# Altium schematic sheet ch340-usb-serial.SchDoc
size A3; SheetNumber: 1; SheetTotal: 1
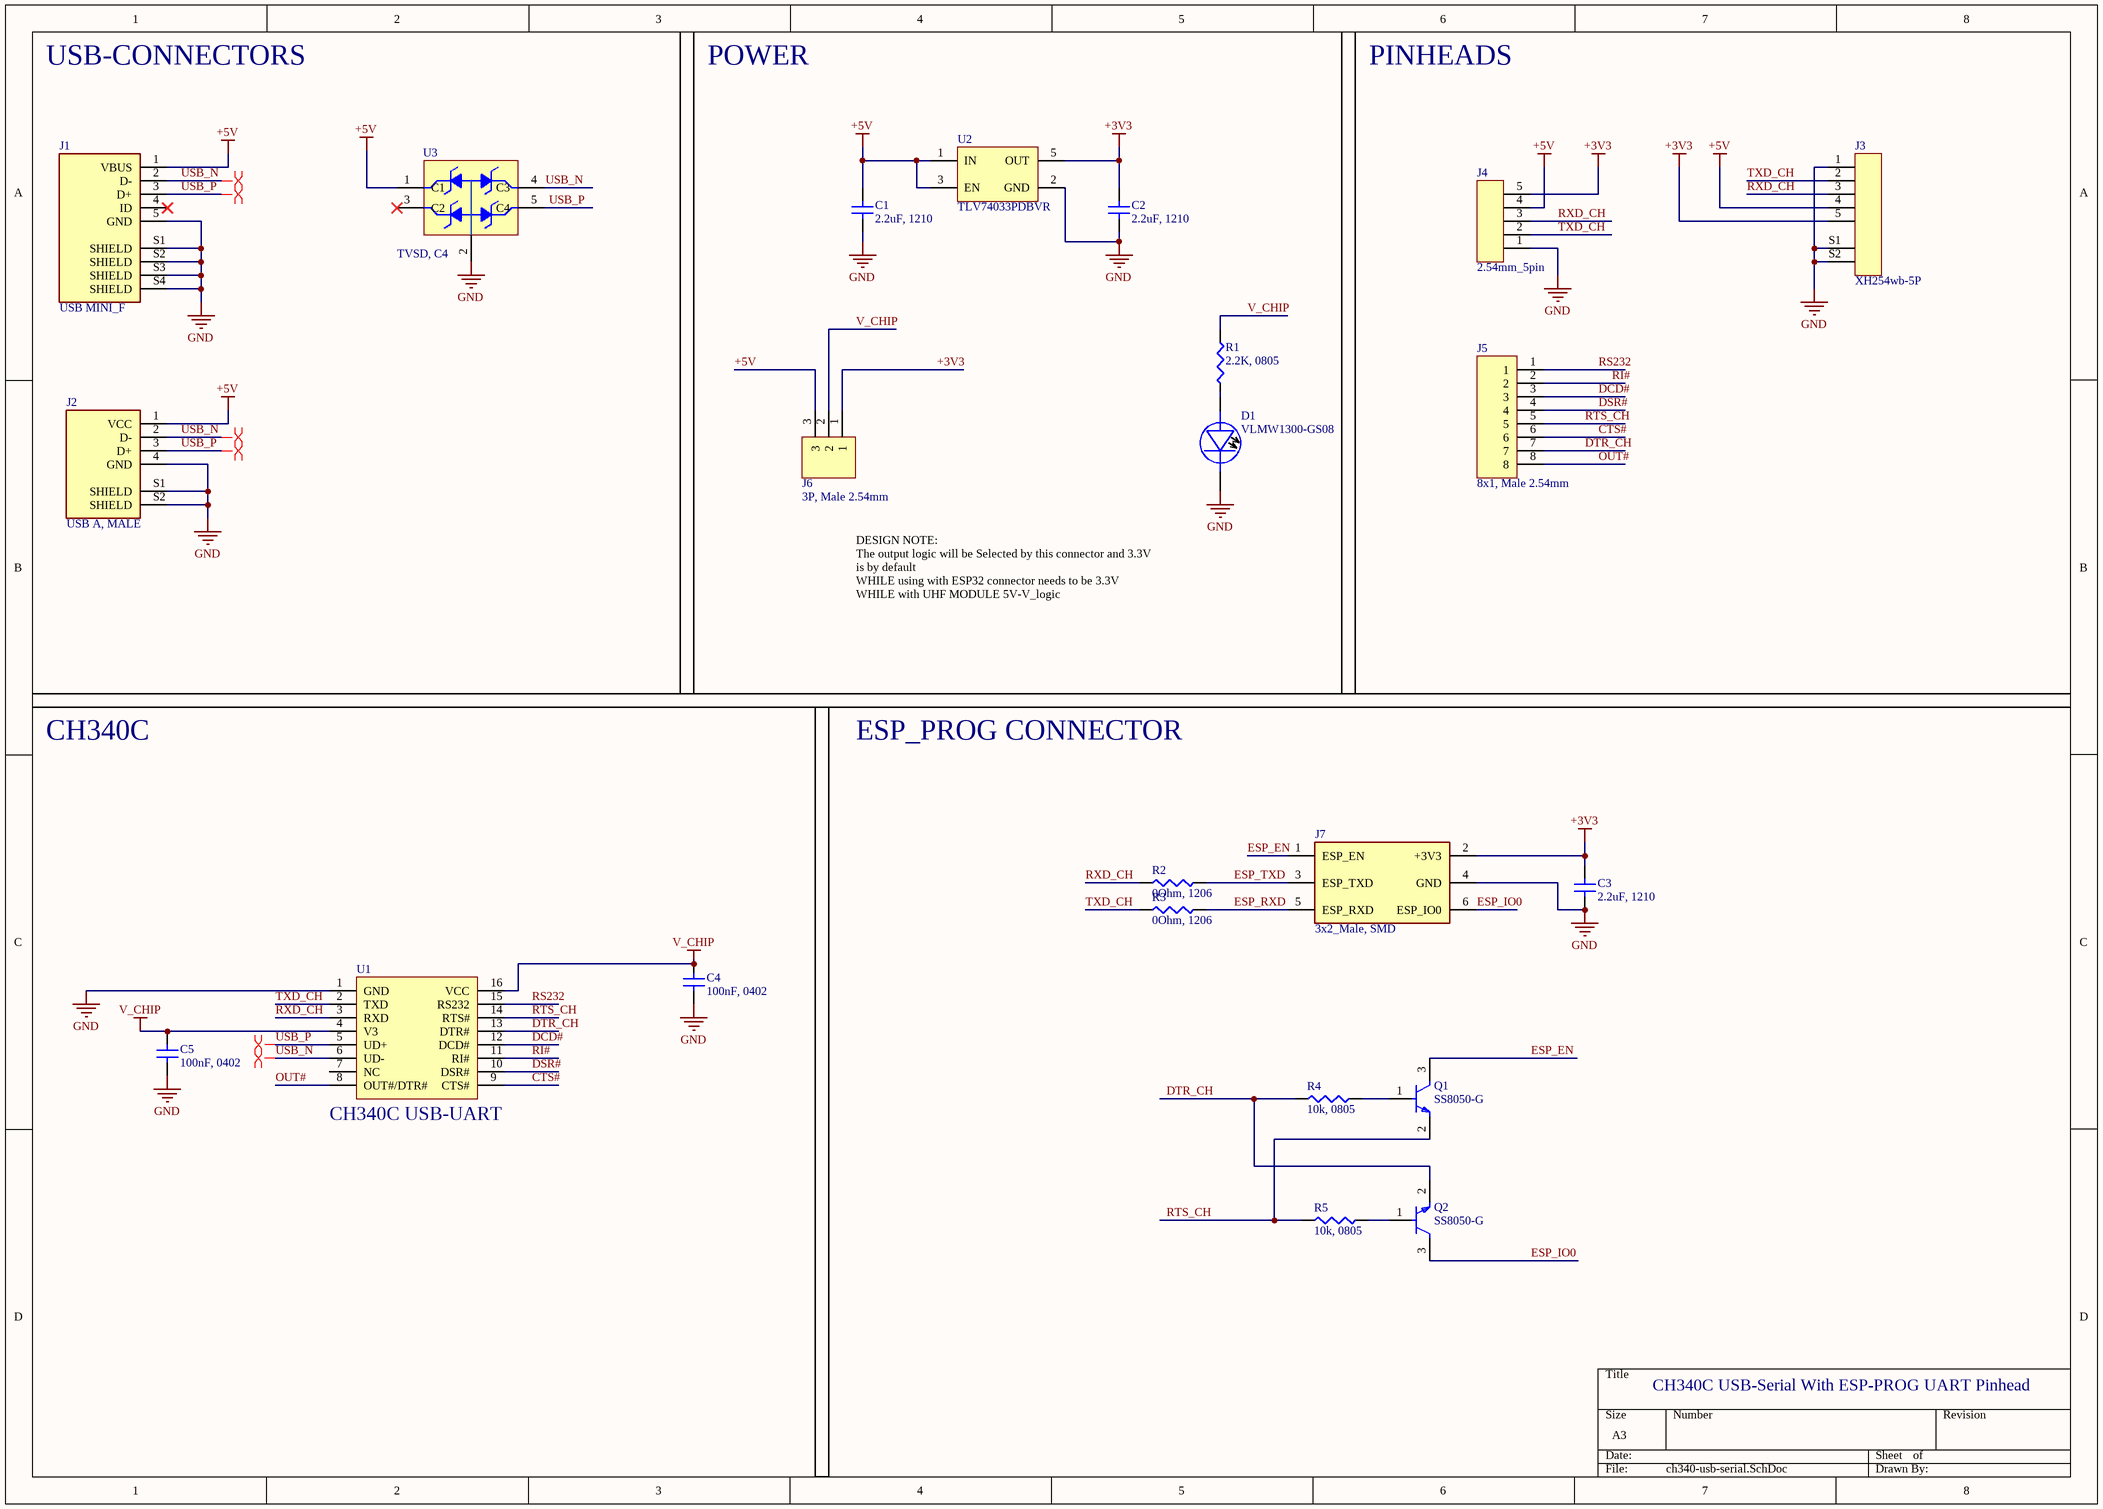
[diagram p0: ch340-usb-serial.SchDoc]

## Parts
C1  2.2uF, 1210  [CAP_1210]
C2  2.2uF, 1210  [CAP_1210]
C3  2.2uF, 1210  [CAP_1210]
C4  100nF, 0402  [CAP_0402]
C5  100nF, 0402  [CAP_0402]
D1  VLMW1300-GS08  [LED_0603]
J1  USB MINI_F  [USB_B_Female]
J2  USB A, MALE  [USB_A_MALE]
J3  XH254wb-5P  [5PIN_Header_Connectotor]
J4  2.54mm_5pin  [5x1P_Male_2.54]
J5  8x1, Male 2.54mm  [8x1P_Male_2.54]
J6  3P, Male 2.54mm  [3x1P_Male_2.54]
J7  3x2_Male, SMD  [3x2P_Male_SMD_1.27]
Q1  SS8050-G  [FP-SS8050-G-IPC_B]
Q2  SS8050-G  [FP-SS8050-G-IPC_B]
R1  2.2K, 0805  [RES_0805]
R2  0Ohm, 1206  [RES_1206]
R3  0Ohm, 1206  [RES_1206]
R4  10k, 0805  [RES_0805]
R5  10k, 0805  [RES_0805]
U1  USB-UART  [SOP16]  (value not drawn)
U2  TLV74033PDBVR  [SOT95P280X145-5N]
U3  TVSD, C4  [SOT353]

## Nets
+3V3: C2.1 C3.1 J3.5 J4.5 J6.1 J7.2(+3V3) U2.5(OUT)
+5V: C1.1 J1.1(VBUS) J2.1(VCC) J3.4 J4.4 J6.3 U2.1(IN) U2.3(EN) U3.1(C1)
GND: C1.2 C2.2 C3.2 C4.1 C5.1 D1.K- J1.5(GND) J1.S1(SHIELD) J1.S2(SHIELD) J1.S3(SHIELD) J1.S4(SHIELD) J2.4(GND) J2.S1(SHIELD) J2.S2(SHIELD) J3.1 J3.S1 J3.S2 J4.1 J7.4(GND) U1.1(GND) U2.2(GND) U3.2(A)
V_CHIP: C4.2 C5.2 J6.2 R1.2 U1.4(V3) U1.16(VCC)
CTS#: J5.6 U1.9(CTS#)
DCD#: J5.3 U1.12(DCD#)
DSR#: J5.4 U1.10(DSR#)
DTR_CH: J5.7 Q2.2(E) R4.1 U1.13(DTR#)
ESP_EN: J7.1(ESP_EN) Q1.3(C)
ESP_IO0: J7.6(ESP_IO0) Q2.3(C)
ESP_RXD: J7.5(ESP_RXD) R3.2
ESP_TXD: J7.3(ESP_TXD) R2.2
OUT#: J5.8 U1.8(OUT#/DTR#)
RI#: J5.2 U1.11(RI#)
RS232: J5.1 U1.15(RS232)
RTS_CH: J5.5 Q1.2(E) R5.1 U1.14(RTS#)
RXD_CH: J3.3 J4.3 R2.1 U1.3(RXD)
TXD_CH: J3.2 J4.2 R3.1 U1.2(TXD)
USB_N: J1.2(D-) J2.2(D-) U1.6(UD-) U3.4(C3)
USB_P: J1.3(D+) J2.3(D+) U1.5(UD+) U3.5(C4)
NetD1_A+: D1.A+ R1.1
NetQ1_1: Q1.1(B) R4.2
NetQ2_1: Q2.1(B) R5.2

Not connected (* = marked no-connect by the designer): J1 4(ID)*; U1 7(NC); U3 3(C2)*

## Layout directives
differential pair; differential pair class DIFF90: USB_N, USB_P

## Notes on the sheet
- USB-CONNECTORS
- POWER
- PINHEADS
- DESIGN NOTE:
  The output logic will be Selected by this connector and 3.3V is by default
  WHILE using with ESP32 connector needs to be 3.3V
  WHILE with UHF MODULE 5V-V_logic
- CH340C
- ESP_PROG CONNECTOR
- CH340C USB-Serial With ESP-PROG UART Pinhead
- (in symbol CH340C) CH340C USB-UART

## Library data of the parts
C1-C3 = CL32B225KCJSNNE: CAP CER 2.2UF 100V X7R 1210; Manufacturer: Samsung; Dielectric Material: Ceramic; Multilayer: Yes; Tolerance  (fill in as +-): 10%; Supplier: Digikey; Supplier Part Number: 1276-3362-6-ND; Manufacturer Part Number: CL32B225KCJSNNE; RoHS: Yes; Category: Ceramic Capacitors; Stock: 239814; Pricing: 1=0.43, 10=0.286, 50=0.228, 100=0.1882, 500=0.14706 (USD); Mounting Technology: Surface Mount; Pins: 2; Package Shape: Rectangular; Case/Package: 1210; Terminal Finish: Nickel; Min Operating Temperature: -55°C; Max Operating Temperature: 125°C; JESD-609 Code: e3; Value: 2.2uF; Capacitor Type: Ceramic; Packaging: Tape and Reel; Tolerance (fill in as +-): 10%; Rated DC Voltage (URdc): 100V; Temperature Characteristics Code: X7R; Termination: Wraparound; Reach SVHC Compliant: Yes; RoHS Compliant: Yes; ComponentLink1URL: https://datasheet.ciiva.com:443/pdfs/VipMasterIC/IC/SEMS/SEMS-S-A0008526420/SEMS-S-A0008525306-1.pdf?src-supplier=IHS+Markit; ComponentLink1Description: https://datasheet.ciiva.com:443/pdfs/VipMasterIC/IC/SEMS/SEMS-S-A0008526420/SEMS-S-A0008525306-1.pdf?src-supplier=IHS+Markit; ComponentLink2URL: https://datasheet.ciiva.com/25791/cl32b225kcjsnne-25791527.pdf?src-supplier=Digikey; ComponentLink2Description: https://datasheet.ciiva.com/25791/cl32b225kcjsnne-25791527.pdf?src-supplier=Digikey; ComponentLink3URL: https://datasheet.ciiva.com/26947/getdatasheetpartid-357497-26947037.pdf?src-supplier=Verical; ComponentLink3Description: https://datasheet.ciiva.com/26947/getdatasheetpartid-357497-26947037.pdf?src-supplier=Verical; ComponentLink4URL: https://datasheet.ciiva.com/16437/cl32b225kcjsnne-16437175.pdf?src-supplier=Future+Electronics; ComponentLink4Description: https://datasheet.ciiva.com/16437/cl32b225kcjsnne-16437175.pdf?src-supplier=Future+Electronics
C4 C5 = CL05B104KB54PNC: 0.1 µF ±10% 50V Ceramic Capacitor X7R 0402 (1005 Metric); Manufacturer: Samsung; Material: 4241ConductorMaterial; Supplier: Arrow Electronics; Supplier Part Number: CL05B104KB54PNC; Manufacturer Part Number: CL05B104KB54PNC; RoHS: Yes; Category: Ceramic Capacitors; Stock: 2120000; Pricing: 10000=0.0057 (USD); Case/Package: 343Case; Min Operating Temperature: -55°C; Max Operating Temperature: 125°C; Tolerance: 10%; Voltage Rating: 50V; Value: 100nF; Height: 550um; RoHS Compliant: Yes; ComponentLink1URL: https://datasheet.octopart.com/CL05B104KB54PNC-Samsung-datasheet-8326407.pdf?src-supplier=TME; ComponentLink1Description: https://datasheet.octopart.com/CL05B104KB54PNC-Samsung-datasheet-8326407.pdf?src-supplier=TME; LCSC Part Number: C307331
D1 = VLMW1300-GS08: LED COOL WHITE 0603 SMD; Manufacturer: Vishay Semiconductors; Shape: Rectangular; Additional Feature: HIGH RELIABILITY; Forward Current: 20mA; Forward Voltage: 3.15V; Luminous Intensity-Nom: 112.5mcd; Channels: 1; Optoelectronic Device Type: SINGLE COLOR LED; Viewing Angle: 130°; Overall Height: 0.55mm; Supplier: Digikey; Supplier Part Number: VLMW1300-GS08CT-ND; Manufacturer Part Number: VLMW1300-GS08; RoHS: Yes; Category: LEDs; Stock: 7313; Pricing: 1=0.46, 10=0.266, 100=0.1687, 500=0.13056, 1000=0.11887 (USD); Mounting Technology: Surface Mount; Pins: 2; Color: White; Color@wavelength: White; Min Operating Temperature: -20°C; Max Operating Temperature: 80°C; Packaging: Tape and Reel; Size: 1.1mm; Terminal Pitch: 1.5mm; Reach SVHC Compliant: Yes; RoHS Compliant: Yes; ComponentLink1URL: https://datasheet.ciiva.com:443/pdfs/VipMasterIC/IC/VISH/VISH-S-A0001807432/VISH-S-A0001807432-1.pdf?src-supplier=IHS+Markit; ComponentLink1Description: https://datasheet.ciiva.com:443/pdfs/VipMasterIC/IC/VISH/VISH-S-A0001807432/VISH-S-A0001807432-1.pdf?src-supplier=IHS+Markit; ComponentLink2URL: https://datasheet.ciiva.com/6858/vlmw1300-6858354.pdf?src-supplier=Newark; ComponentLink2Description: https://datasheet.ciiva.com/6858/vlmw1300-6858354.pdf?src-supplier=Newark; ComponentLink3URL: https://datasheet.ciiva.com/4688/vlmw1300-98499-4688159.pdf?src-supplier=Mouser; ComponentLink3Description: https://datasheet.ciiva.com/4688/vlmw1300-98499-4688159.pdf?src-supplier=Mouser; ComponentLink4URL: https://datasheet.ciiva.com/14650/vlmw1300-14650411.pdf?src-supplier=Element14; ComponentLink4Description: https://datasheet.ciiva.com/14650/vlmw1300-14650411.pdf?src-supplier=Element14; ComponentLink5URL: https://datasheet.ciiva.com/14650/vlmw1300-14650412.pdf?src-supplier=Element14; ComponentLink5Description: https://datasheet.ciiva.com/14650/vlmw1300-14650412.pdf?src-supplier=Element14; ComponentLink6URL: https://datasheet.ciiva.com/16388/vlmw1300-16388055.pdf?src-supplier=Future+Electronics; ComponentLink6Description: https://datasheet.ciiva.com/16388/vlmw1300-16388055.pdf?src-supplier=Future+Electronics
J1 = GMSB0532112YEU: MINI USB B TYPE RECEPTACLE 5POS; Manufacturer: Amphenol; Supplier: Digikey; Supplier Part Number: 664-GMSB0532112YEUDKR-ND; Manufacturer Part Number: GMSB0532112YEU; RoHS: No; Category: Connectors; Stock: 5615; Pricing: 1=0.55, 10=0.476, 25=0.4352, 50=0.4094, 100=0.3924, 250=0.35824, 500=0.34118 (USD)
J2 = 0480372200: CONN PLUG USB2.0 TYPEA 4P SMD RA; Manufacturer: Molex; Option: General Purpose; Empty Shell: No; Number of Contacts: 4; Mating Information: MULTIPLE MATING PARTS AVAILABLE; Supplier: Digikey; Supplier Part Number: WM3983CT-ND; Manufacturer Part Number: 0480372200; RoHS: Yes; Stock: 18158; Pricing: 1=1.45, 10=1.199, 100=0.9993 (USD); Mounting Technology: Panel,Board; Contact Finish - Mating: GOLD (30); Contact Finish - Termination: TIN; Connector Type: USB; Body/Shell Style: PLUG; Contact Gender: Male; Filter Feature: No; Mixed Contacts: No; Mounting Style: RIGHT ANGLE; Termination: SMD/SMT; JESD-609 Code: e3; Reach SVHC Compliant: Yes; RoHS Compliant: Yes; DIN Conformance: No; IEC Conformance: No; MIL Conformance: No; ComponentLink1URL: https://datasheet.ciiva.com:443/pdfs/VipMasterIC/IC/MOLE/MOLES33218/MOLES28897-1.pdf?src-supplier=IHS+Markit; ComponentLink1Description: https://datasheet.ciiva.com:443/pdfs/VipMasterIC/IC/MOLE/MOLES33218/MOLES28897-1.pdf?src-supplier=IHS+Markit
J3 = XH254wb-5P: SMT SMD Horizontal Socket Male Header Connector
J4 = 2.54mm_5pin: CONN HEADER VERT 5POS 2.54MM
J5 = 61300811121: CONN HEADER VERT 8POS 2.54MM; Manufacturer: Wurth Electronics; Manufacturer Series: 613; Connector Type: BOARD CONNECTOR; Body/Shell Style: PLUG; Contact Pattern: RECTANGULAR; Contact Resistance: 20mR; Contact Style: SQ PIN-SKT; Dielectric Withstanding Voltage (AC): 500V; Insulation Resistance: 1GR; Number Of Connectors: 1; Rated Current (Signal): 3A; Number of Contacts: 8; Body Breadth: 0.1inch; Body Length: 0.8inch; Mounting Option 1: LOCKING; Reference Standard: UL; Reliability: COMMERCIAL; Supplier: Digikey; Supplier Part Number: 732-5321-ND; Manufacturer Part Number: 61300811121; RoHS: Yes; Category: Headers and Wire Housings; Stock: 8009; Pricing: 1=0.39, 10=0.336, 25=0.28, 50=0.234, 100=0.212, 1000=0.193 (USD); Mounting Technology: Board; Contact Material: Copper Alloy; Contact Finish - Mating: AU; Contact Finish - Termination: Gold (Au) - with Nickel (Ni) barrier; Insulation Color: Black; Insulation Material: Polybutylene; Min Operating Temperature: -40°C; Max Operating Temperature: 125°C; JESD-609 Code: e4; Contact Gender: Male; Mounting Style: STRAIGHT; Number of Rows Loaded: 1; PCB Contact Pattern: RECTANGULAR; Termination: Solder; Body Depth: 0.1inch; Mating Contact Pitch: 0.1inch; Terminal Length: 0.118inch; Terminal Pitch: 2.54mm; Reach SVHC Compliant: Yes; RoHS Compliant: Yes; ComponentLink1URL: https://datasheet.ciiva.com:443/pdfs/VipMasterIC/IC/MIDC/MIDCS07676/MIDCS07676-1.pdf?src-supplier=IHS+Markit; ComponentLink1Description: https://datasheet.ciiva.com:443/pdfs/VipMasterIC/IC/MIDC/MIDCS07676/MIDCS07676-1.pdf?src-supplier=IHS+Markit; ComponentLink2URL: https://datasheet.octopart.com/61300811121-W%C3%BCrth-Elektronik-datasheet-21154836.pdf?src-supplier=Element14; ComponentLink2Description: https://datasheet.octopart.com/61300811121-W%C3%BCrth-Elektronik-datasheet-21154836.pdf?src-supplier=Element14; ComponentLink3URL: https://katalog.we-online.de/em/datasheet/6130xx11121.pdf?src-supplier=Digikey; ComponentLink3Description: https://katalog.we-online.de/em/datasheet/6130xx11121.pdf?src-supplier=Digikey
J6 = 61300311121: CONN HEADER VERT 3POS 2.54MM; Manufacturer: Wurth Electronics; Connector Type: BOARD CONNECTOR; Body/Shell Style: PLUG; Contact Pattern: RECTANGULAR; Contact Resistance: 20mR; Contact Style: SQ PIN-SKT; Dielectric Withstanding Voltage (AC): 500V; Insulation Resistance: 1GR; Number Of Connectors: 1; Rated Current (Signal): 3A; Number of Contacts: 3; Body Breadth: 0.1inch; Body Length: 0.3inch; Mounting Option 1: LOCKING; Reference Standard: UL; Reliability: COMMERCIAL; Supplier: Digikey; Supplier Part Number: 732-5316-ND; Manufacturer Part Number: 61300311121; RoHS: Yes; Category: Headers and Wire Housings; Stock: 134142; Pricing: 1=0.13, 10=0.113, 25=0.094, 50=0.079, 100=0.071, 1000=0.066 (USD); Mounting Technology: Board; Contact Material: Copper Alloy; Contact Finish - Mating: GOLD; Contact Finish - Termination: Gold (Au) - with Nickel (Ni) barrier; Insulation Color: Black; Insulation Material: Polybutylene; Min Operating Temperature: -40°C; Max Operating Temperature: 125°C; JESD-609 Code: e4; Contact Gender: Male; Mounting Style: STRAIGHT; Number of Rows Loaded: 1; PCB Contact Pattern: RECTANGULAR; Termination: Solder; Body Depth: 0.1inch; Mating Contact Pitch: 0.1inch; Terminal Length: 0.118inch; Terminal Pitch: 2.54mm; Reach SVHC Compliant: Yes; RoHS Compliant: Yes; ComponentLink1URL: https://datasheet.ciiva.com:443/pdfs/VipMasterIC/IC/MIDC/MIDCS07676/MIDCS07676-1.pdf?src-supplier=IHS+Markit; ComponentLink1Description: https://datasheet.ciiva.com:443/pdfs/VipMasterIC/IC/MIDC/MIDCS07676/MIDCS07676-1.pdf?src-supplier=IHS+Markit; ComponentLink2URL: http://www.farnell.com/cad/1737268.pdf?src-supplier=Element14; ComponentLink2Description: http://www.farnell.com/cad/1737268.pdf?src-supplier=Element14; ComponentLink3URL: https://datasheet.octopart.com/61300311121-W%C3%BCrth-Elektronik-datasheet-21154836.pdf?src-supplier=Element14; ComponentLink3Description: https://datasheet.octopart.com/61300311121-W%C3%BCrth-Elektronik-datasheet-21154836.pdf?src-supplier=Element14; ComponentLink4URL: https://katalog.we-online.de/em/datasheet/6130xx11121.pdf?src-supplier=Digikey; ComponentLink4Description: https://katalog.we-online.de/em/datasheet/6130xx11121.pdf?src-supplier=Digikey
J7 = 20021121-00006C4LF: CONN HEADER SMD 6POS 1.27MM; Manufacturer: Amphenol Communications Solutions; Supplier: Digikey; Supplier Part Number: 609-3693-1-ND; Manufacturer Part Number: 20021121-00006C4LF; RoHS: No; Category: Headers and Wire Housings; Stock: 7493; Pricing: 1=0.8, 10=0.612, 100=0.4694 (USD)
Q1 Q2 = SS8050-G: TRANS NPN 25V 1.5A SOT23-3; Manufacturer: Comchip; Supplier: Digikey; Supplier Part Number: 641-1790-1-ND; Manufacturer Part Number: SS8050-G; RoHS: Yes; Category: Transistors; Stock: 90458; Pricing: 1=0.29, 10=0.2, 100=0.0978, 500=0.08154, 1000=0.05666 (USD); Reach SVHC Compliant: Yes; RoHS Compliant: Yes; ComponentLink1URL: https://datasheet.ciiva.com:443/pdfs/VipMasterIC/IC/COMC/COMC-S-A0004994192/COMC-S-A0004994192-1.pdf?src-supplier=IHS+Markit; ComponentLink1Description: https://datasheet.ciiva.com:443/pdfs/VipMasterIC/IC/COMC/COMC-S-A0004994192/COMC-S-A0004994192-1.pdf?src-supplier=IHS+Markit; ComponentLink2URL: http://www.comchiptech.com/admin/files/product/SS8050-G RevA181526.pdf?src-supplier=Digikey; ComponentLink2Description: http://www.comchiptech.com/admin/files/product/SS8050-G RevA181526.pdf?src-supplier=Digikey; LCSC Part Number: C164886
R1 = CRCW08052K20FKEC: RES SMD 2.2K OHM 1% 1/8W 0805; Manufacturer: Vishay Dale; Power: 125mW; Rated Temperature: 70°C; Value: 2.2kR; Temperature Coefficient: 100ppm/°C; Working Voltage: 150V; Package Height: 0.45mm; Package Length: 2mm; Package Width: 1.25mm; Reference Standard: AEC-Q200; Supplier: Digikey; Supplier Part Number: 541-CRCW08052K20FKECCT-ND; Manufacturer Part Number: CRCW08052K20FKEC; RoHS: Yes; Category: Chip SMD Resistors; Stock: 19945; Pricing: 1=0.1, 10=0.039, 50=0.025, 100=0.021, 500=0.01444, 1000=0.0125, 5000=0.00933, 10000=0.00838 (USD); Mounting Technology: Surface Mount; Pins: 2; Package Shape: Rectangular; Case/Package: 0805; Terminal Finish: Nickel; Min Operating Temperature: -55°C; Max Operating Temperature: 155°C; Tolerance: 1%; JESD-609 Code: e3; Resistor Type: FIXED RESISTOR; Construction: Chip; Package Style: SMTMeter; Packaging: Tape and Reel; Technology: METAL GLAZE/THICK FILM; Termination: Wraparound; Reach SVHC Compliant: Yes; RoHS Compliant: Yes; ComponentLink1URL: https://datasheet.ciiva.com:443/pdfs/VipMasterIC/IC/VISH/VISH-S-A0007266705/VISH-S-A0007266705-1.pdf?src-supplier=IHS+Markit; ComponentLink1Description: https://datasheet.ciiva.com:443/pdfs/VipMasterIC/IC/VISH/VISH-S-A0007266705/VISH-S-A0007266705-1.pdf?src-supplier=IHS+Markit; ComponentLink2URL: http://www.vishay.com/docs/20035/dcrcwe3.pdf?src-supplier=Digikey; ComponentLink2Description: http://www.vishay.com/docs/20035/dcrcwe3.pdf?src-supplier=Digikey
R2 R3 = RC1206JR-070RL: RES 0 OHM JUMPER 1/4W 1206; Manufacturer: Yageo; Power: 250mW; Rated Temperature: 70°C; Value: 0R; Package Height: 0.55mm; Package Length: 3.1mm; Package Width: 1.6mm; Supplier: Digikey; Supplier Part Number: 311-0.0ERCT-ND; Manufacturer Part Number: RC1206JR-070RL; RoHS: Yes; Category: Chip SMD Resistors; Stock: 903635; Pricing: 1=0.1, 10=0.048, 25=0.0364, 50=0.0276, 100=0.0193, 250=0.01556, 500=0.01244, 1000=0.00915 (USD); Mounting Technology: Surface Mount; Pins: 2; Package Shape: Rectangular; Case/Package: 1206; Terminal Finish: Nickel; Min Operating Temperature: -55°C; Max Operating Temperature: 155°C; JESD-609 Code: e3; Resistor Type: FIXED RESISTOR; Construction: Chip; Package Style: SMTMeter; Packaging: Tape and Reel; Technology: METAL GLAZE/THICK FILM; Termination: Wraparound; Reach SVHC Compliant: Yes; RoHS Compliant: Yes; ComponentLink1URL: https://datasheet.ciiva.com:443/pdfs/VipMasterIC/IC/YAGO/YAGO-S-A0008145938/YAGO-S-A0008145938-1.pdf?src-supplier=IHS+Markit; ComponentLink1Description: https://datasheet.ciiva.com:443/pdfs/VipMasterIC/IC/YAGO/YAGO-S-A0008145938/YAGO-S-A0008145938-1.pdf?src-supplier=IHS+Markit; ComponentLink2URL: https://datasheet.ciiva.com/11808/0900766b80c6630a-11808156.pdf?src-supplier=Rs; ComponentLink2Description: https://datasheet.ciiva.com/11808/0900766b80c6630a-11808156.pdf?src-supplier=Rs; ComponentLink3URL: https://datasheet.ciiva.com/29181/402222-da-01-en-smd-widerstand-0-ohm-1206-29181568.pdf?src-supplier=Conrad; ComponentLink3Description: https://datasheet.ciiva.com/29181/402222-da-01-en-smd-widerstand-0-ohm-1206-29181568.pdf?src-supplier=Conrad; ComponentLink4URL: https://datasheet.ciiva.com/22747/1692832-22747541.pdf?src-supplier=Element14; ComponentLink4Description: https://datasheet.ciiva.com/22747/1692832-22747541.pdf?src-supplier=Element14; ComponentLink5URL: https://datasheet.ciiva.com/46445/444357-46445719.pdf?src-supplier=Element14; ComponentLink5Description: https://datasheet.ciiva.com/46445/444357-46445719.pdf?src-supplier=Element14; ComponentLink6URL: https://datasheet.ciiva.com/17035/pyu-rc1206-51-rohs-l-4-17035512.pdf?src-supplier=Future+Electronics; ComponentLink6Description: https://datasheet.ciiva.com/17035/pyu-rc1206-51-rohs-l-4-17035512.pdf?src-supplier=Future+Electronics
R4 R5 = RC0805FR-0710KL: RES 10K OHM 1% 1/8W 0805; Manufacturer: Yageo; Additional Feature: LASER TRIMMABLE; Power: 125mW; Rated Temperature: 70°C; Value: 10kR; Temperature Coefficient: 100ppm/°C; Working Voltage: 150V; Package Height: 0.5mm; Package Length: 2mm; Package Width: 1.25mm; Supplier: Digikey; Supplier Part Number: 311-10.0KCRCT-ND; Manufacturer Part Number: RC0805FR-0710KL; RoHS: Yes; Category: Chip SMD Resistors; Stock: 1781403; Pricing: 1=0.1, 10=0.027, 50=0.017, 100=0.0142, 500=0.00976, 1000=0.00844 (USD); Mounting Technology: Surface Mount; Pins: 2; Package Shape: Rectangular; Case/Package: 0805; Terminal Finish: Nickel; Min Operating Temperature: -55°C; Max Operating Temperature: 155°C; Tolerance: 1%; JESD-609 Code: e3; Resistor Type: FIXED RESISTOR; Construction: Chip; Package Style: SMTMeter; Packaging: Tape and Reel; Technology: METAL GLAZE/THICK FILM; Termination: Wraparound; Reach SVHC Compliant: Yes; RoHS Compliant: Yes; ComponentLink1URL: https://datasheet.ciiva.com:443/pdfs/VipMasterIC/IC/YAGO/YAGO-S-A0008145938/YAGO-S-A0008145938-1.pdf?src-supplier=IHS+Markit; ComponentLink1Description: https://datasheet.ciiva.com:443/pdfs/VipMasterIC/IC/YAGO/YAGO-S-A0008145938/YAGO-S-A0008145938-1.pdf?src-supplier=IHS+Markit
U1 = CH340C: SOP-16 USB to UART Converters
U2 = TLV74033PDBVR: IC REG LINEAR 3.3V 300MA SOT23-5
U3 = DF5A5.6FUTE85LF: TVS Quad Common Anode 5.6V 200mW 5-Pin SOT-353 Embossed T/R; Manufacturer: Toshiba; Supplier: Digikey; Supplier Part Number: DF5A5.6FUTE85LFCT-ND; Manufacturer Part Number: DF5A5.6FUTE85LF; RoHS: Yes; Category: TVS Diodes; Stock: 11607; Pricing: 1=0.34, 10=0.21, 100=0.1318, 500=0.09776, 1000=0.08675 (USD); ComponentLink1URL: https://datasheet.ciiva.com/29853/dst-df5a5-6fu-tde-en-9420-29853417.pdf?src-supplier=Digikey; ComponentLink1Description: https://datasheet.ciiva.com/29853/dst-df5a5-6fu-tde-en-9420-29853417.pdf?src-supplier=Digikey; ComponentLink2URL: https://datasheet.ciiva.com/29853/dst-df5a5-6fu-tde-en-9420-29853419.pdf?src-supplier=Digikey; ComponentLink2Description: https://datasheet.ciiva.com/29853/dst-df5a5-6fu-tde-en-9420-29853419.pdf?src-supplier=Digikey; ComponentLink3URL: https://datasheet.ciiva.com/29853/dst-df5a5-6fu-tde-en-9420-29853418.pdf?src-supplier=Digikey; ComponentLink3Description: https://datasheet.ciiva.com/29853/dst-df5a5-6fu-tde-en-9420-29853418.pdf?src-supplier=Digikey